# EAGLE design master_pi (EAGLE 8.0.2)
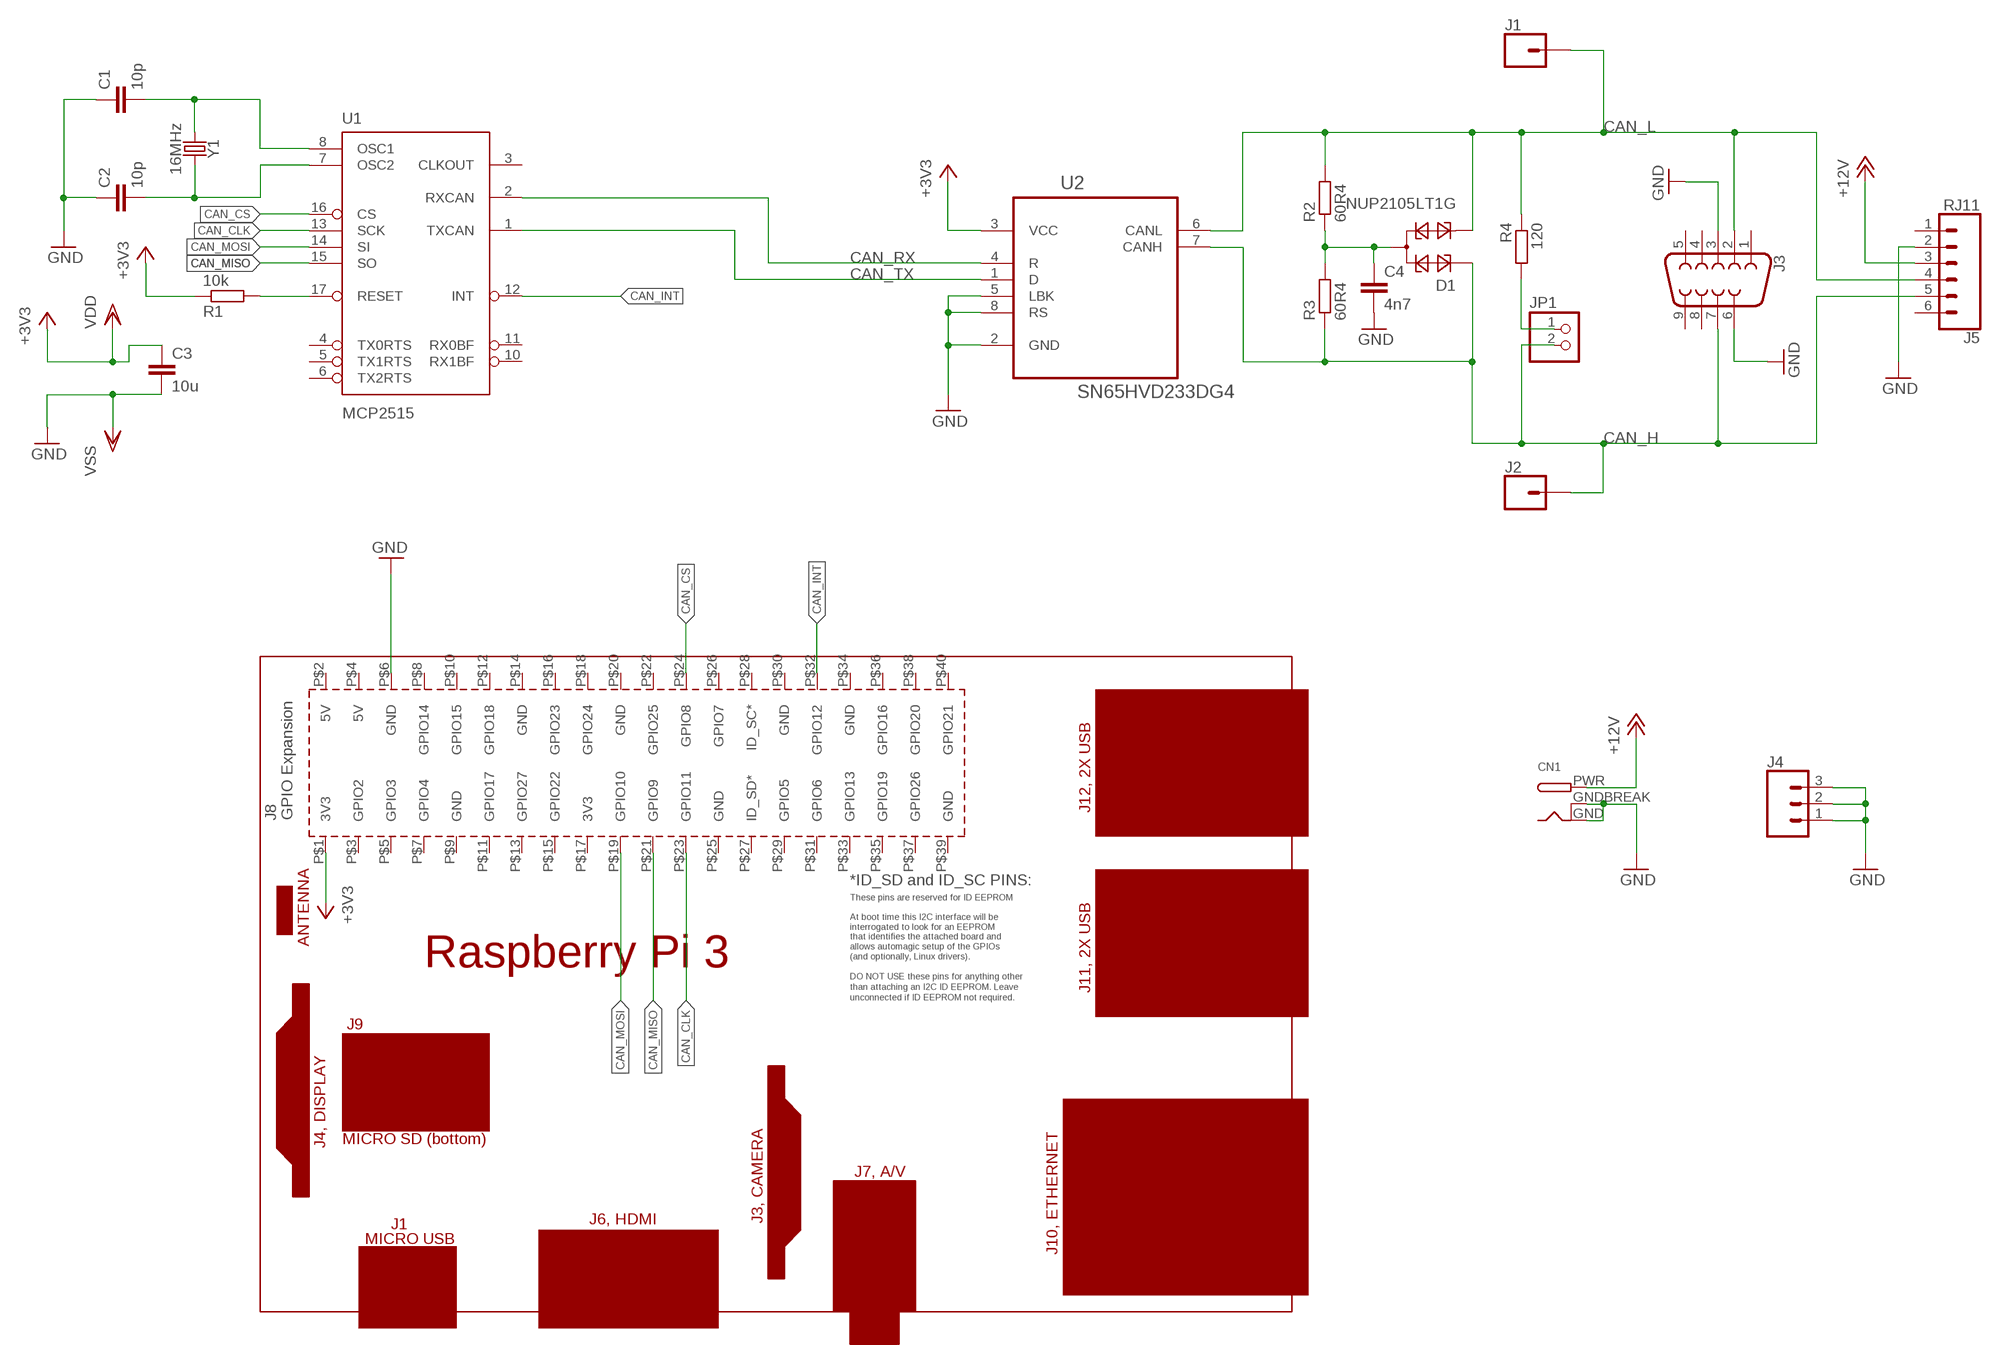
[diagram p0: schematic, sheet 1]

## Parts
C1  10p  C-EUC1206  [C1206]
C2  10p  C-EUC1206  [C1206]
C3  10u  C-EUC1206  [C1206]
C4  4n7  C-EUC1206  [C1206]
CN1  DCBARRELPTH  [DCJACK_2MM_PTH]
D1  NUP2105LT1G  PESD1CAN  [SOT23]
J1  CONN_01  [1X01]
J2  CONN_01  [1X01]
J3  DB9FEMALE  [DB9]
J4  CONN_03  [1X03]
J5  RJ11  RJ11-6  [RJ11-6]
JP1  PINHD-1X2  [1X02]
PCB1  RPI3  [RPI3]
R1  10k  R-EU_R1206  [R1206]
R2  60R4  R-EU_R1206  [R1206]
R3  60R4  R-EU_R1206  [R1206]
R4  120  R-EU_R1206  [R1206]
U1  MCP2515  MCP2515(MCP2510)SO  [SO18W]
U2  SN65HVD233DG4  [SOIC127P600X175-8N]
Y1  16MHz  CRYSTAL-16MHZPTH-HC49US  [HC49US]

## Nets
+3V3 [3v3]: C3.1 PCB1.P$1(3V3) R1.1 U2.3(VCC) ; supply symbol labelled VDD
+12V: CN1.PWR J5.3
CAN_CLK: PCB1.P$23(GPIO11) U1.13(SCK)
CAN_CS: PCB1.P$24(GPIO8) U1.16(CS)
CAN_H: D1.1 J2.1 J3.7 J5.5 JP1.2 R3.1 U2.7(CANH)
CAN_INT: PCB1.P$32(GPIO12) U1.12(INT)
CAN_L: D1.2 J1.1 J3.2 J5.4 R2.2 R4.1 U2.6(CANL)
CAN_MISO: PCB1.P$21(GPIO9) U1.15(SO)
CAN_MOSI: PCB1.P$19(GPIO10) U1.14(SI)
CAN_RX: U1.2(RXCAN) U2.4(R)
CAN_TX: U1.1(TXCAN) U2.1(D)
GND: C1.1 C2.1 C3.2 C4.2 CN1.GND CN1.GNDBREAK J3.3 J3.6 J4.1 J4.2 J4.3 J5.2 PCB1.P$6(GND) U2.2(GND) U2.5(LBK) U2.8(RS) ; supply symbol labelled VSS
N$1: R1.2 U1.17(RESET)
N$2: C4.1 D1.3 R2.1 R3.2
N$12: C1.2 U1.8(OSC1) Y1.1
N$13: C2.2 U1.7(OSC2) Y1.2
N$38: JP1.1 R4.2
Unconnected: J3.1 J3.4 J3.5 J3.8 J3.9 J5.1 J5.6 PCB1.P$2(5V) PCB1.P$3(GPIO2) PCB1.P$4(5V) PCB1.P$5(GPIO3) PCB1.P$7(GPIO4) PCB1.P$8(GPIO14) PCB1.P$9(GND) PCB1.P$10(GPIO15) PCB1.P$11(GPIO17) PCB1.P$12(GPIO18) PCB1.P$13(GPIO27) PCB1.P$14(GND) PCB1.P$15(GPIO22) PCB1.P$16(GPIO23) PCB1.P$17(3V3) PCB1.P$18(GPIO24) PCB1.P$20(GND) PCB1.P$22(GPIO25) PCB1.P$25(GND) PCB1.P$26(GPIO7) PCB1.P$27(ID_SD*) PCB1.P$28(ID_SC*) PCB1.P$29(GPIO5) PCB1.P$30(GND) PCB1.P$31(GPIO6) PCB1.P$33(GPIO13) PCB1.P$34(GND) PCB1.P$35(GPIO19) PCB1.P$36(GPIO16) PCB1.P$37(GPIO26) PCB1.P$38(GPIO20) PCB1.P$39(GND) PCB1.P$40(GPIO21) U1.3(CLKOUT) U1.4(TX0RTS) U1.5(TX1RTS) U1.6(TX2RTS) U1.10(RX1BF) U1.11(RX0BF)

## Power pins joined to a net without a drawn wire
+3V3: U1.18(VDD)
GND: U1.9(VSS)

## Library data of the parts
C1-C4 = resistor:C-EU: CAPACITOR, European symbol
CN1 = adafruit:DCBARREL: 2.0mm DC Barrel Jack DCJACK_2MM_PTH - Through Hole Jack (4UConnector: 05537)
D1 = diode:PESD1CAN: CAN bus ESD protection diode Source: http://www.nxp.com/documents/data_sheet/PESD1CAN.pdf
J1 J2 = SparkFun-Connectors:CONN_01: Single connection point. Often used as Generic Header-pin footprint for 0.1 inch spaced/style header connections On any of the 0.1 inch spaced packages, you can populate with these: Break Away Headers - Straight <https://www.sparkfun.com/products/116> (PRT-00116) Break Away Male Headers - Right Angle <https://www.sparkfun.com/products/553> (PRT-00553) Female Headers <https://www.sparkfun.com/products/115> (PRT-00115) Break Away Headers - Machine Pin <https://www.sparkfun.com/products/117> (PRT-00117) Break Away Female Headers - Swiss Machine Pin <https://www.sparkfun.com/products/743> (PRT-00743) This device is also useful as a general connection point to wire up your design to another part of your project. Our various solder wires solder well into these plated through hole pads. Hook-Up Wire - Assortment (Stranded, 22 AWG) <https://www.sparkfun.com/products/11375> (PRT-11375) Hook-Up Wire - Assortment (Solid Core, 22 AWG) <https://www.sparkfun.com/products/11367> (PRT-11367) View the entire wire category on our website here <https://www.sparkfun.com/categories/141> Special notes: SMTSO-256-ET is a "flush mount" nut for a 4-40 screw. We mostly use this on specialty testbeds; it is a nice way to connect hardware to your PCB at an adjustable hieght. Also note, the SNAP packages are for using a snappable style connector. We sell a baggie of snaps and they are also used on two LilyPad designs: Snap Assortment - 30 pack (male and female) <https://www.sparkfun.com/products/11347> (DEV-11347) LilyPad Arduino SimpleSnap <https://www.sparkfun.com/products/10941> (DEV-10941) LilyPad SimpleSnap Protoboard <https://www.sparkfun.com/products/10940> (DEV-10940)
J3 = SparkFun-Connectors:DB9: DB9 Connector Standard DB9 (D-Sub 9) serial connector. Can be used for CAN bus as well as RS485 and RS232. Footprint production proven. Here is the female version connector we sell at SparkFun: 9 Pin Female Serial Connector - PCB Mount <https://www.sparkfun.com/products/429> (PRT-00429) This connector has been used on the following SparkFun products: SparkFun RS232 Shifter - SMD <https://www.sparkfun.com/products/449> (PRT-00449) SparkFun RS232 Shifter SMD (No DB9) <https://www.sparkfun.com/products/8780> (PRT-08780); PROD_ID: CONN-08194
J4 = SparkFun-Connectors:CONN_03: Multi connection point. Often used as Generic Header-pin footprint for 0.1 inch spaced/style header connections On any of the 0.1 inch spaced packages, you can populate with these: Break Away Headers - Straight <https://www.sparkfun.com/products/116> (PRT-00116) Break Away Male Headers - Right Angle <https://www.sparkfun.com/products/553> (PRT-00553) Female Headers <https://www.sparkfun.com/products/115> (PRT-00115) Break Away Headers - Machine Pin <https://www.sparkfun.com/products/117> (PRT-00117) Break Away Female Headers - Swiss Machine Pin <https://www.sparkfun.com/products/743> (PRT-00743) Stackable Header - 3 Pin (Female, 0.1") <https://www.sparkfun.com/products/13875> (PRT-13875) For SCREWTERMINALS and SPRING TERMINALS visit here: Screw Terimnals on SparkFun.com <https://www.sparkfun.com/search/results?term=Screw+Terminals> (5mm/3.5mm/2.54mm spacing) This device is also useful as a general connection point to wire up your design to another part of your project. Our various solder wires solder well into these plated through hole pads. Hook-Up Wire - Assortment (Stranded, 22 AWG) <https://www.sparkfun.com/products/11375> (PRT-11375) Hook-Up Wire - Assortment (Solid Core, 22 AWG) <https://www.sparkfun.com/products/11367> (PRT-11367) View the entire wire category on our website here <https://www.sparkfun.com/categories/141> Special notes: Molex polarized connector foot print use with SKU : PRT-08232 with associated crimp pins and housings.
J5 = SparkFun-Connectors:RJ11-6: RJ11 Jack - 6 pin Commonly found on CAT3 devices and some Microchip programmers. Here is the connector we sell at SparkFun: RJ11 6-Pin Connector <https://www.sparkfun.com/products/132> (PRT-00132) Datasheet <http://www.sparkfun.com/datasheets/Prototyping/Connectors/RJ11-Datasheet.pdf> It is used on this SparkFun product: SparkFun Weather Shield <https://www.sparkfun.com/products/12081> (DEV-12081) Weather Meters <https://www.sparkfun.com/products/8942> (SEN-08942); PROD_ID: CONN-08590; SF_ID: PRT-00132
JP1 = pinhead:PINHD-1X2: PIN HEADER
PCB1 = e14_Rpi3_RevA:RPI3: Device for Raspberry Pi 3 board created by Dave Young for www.element14.com More information and support community is available at https://www.element14.com/community/community/raspberry-pi
R1-R4 = rcl:R-EU_: RESISTOR, European symbol
U1 = SparkFun-IC-Comms:MCP2515(MCP2510): CAN controller with SPI interface The MCP2515 controller supercedes the MCP2510 while addressing all errata associated with it. The two devices are pin compatible, either can be used with this device. 18-pin package SOIC Simple SPI interface to any MCU. One-shot mode ensures message transmission is attempted only once Databyte filtering Start-of-Frame (SOF) output Low-power CMOS Technology Datasheet <http://www.sparkfun.com/datasheets/DevTools/Arduino/MCP2515.pdf> SparkFun Products CAN-BUS Shield <https://www.sparkfun.com/products/13262> (DEV-13262); PROD_ID: IC-09906
U2 = SN65HVD233DG4:SN65HVD233DG4: CAN TRANSCEIVERS; MPN: SN65HVD233DG4; OC_FARNELL: 1207268; OC_NEWARK: 16M2304; PACKAGE: SOIC-8; SUPPLIER: TI
Y1 = SparkFun-Clocks:CRYSTAL-16MHZ: 16MHz Crystal Digikey Example <http://www.digikey.com/product-search/en?keywords=535-9122-1-ND> Frequency: 16MHz Frequency Stability: ±50ppm Frequency Tolerance: ±20ppm Load Capacitance: 18pF SparkFun Products: Pro Micro -5V/16MHz <https://www.sparkfun.com/products/12640> SparkFun Serial Enabled LCD Kit <https://www.sparkfun.com/products/10097>; PROD_ID: XTAL-08181; SF_ID: COM-00536

## Net classes
0 default: width 0.25 mm
2 3v3: width 0.75 mm

## Board
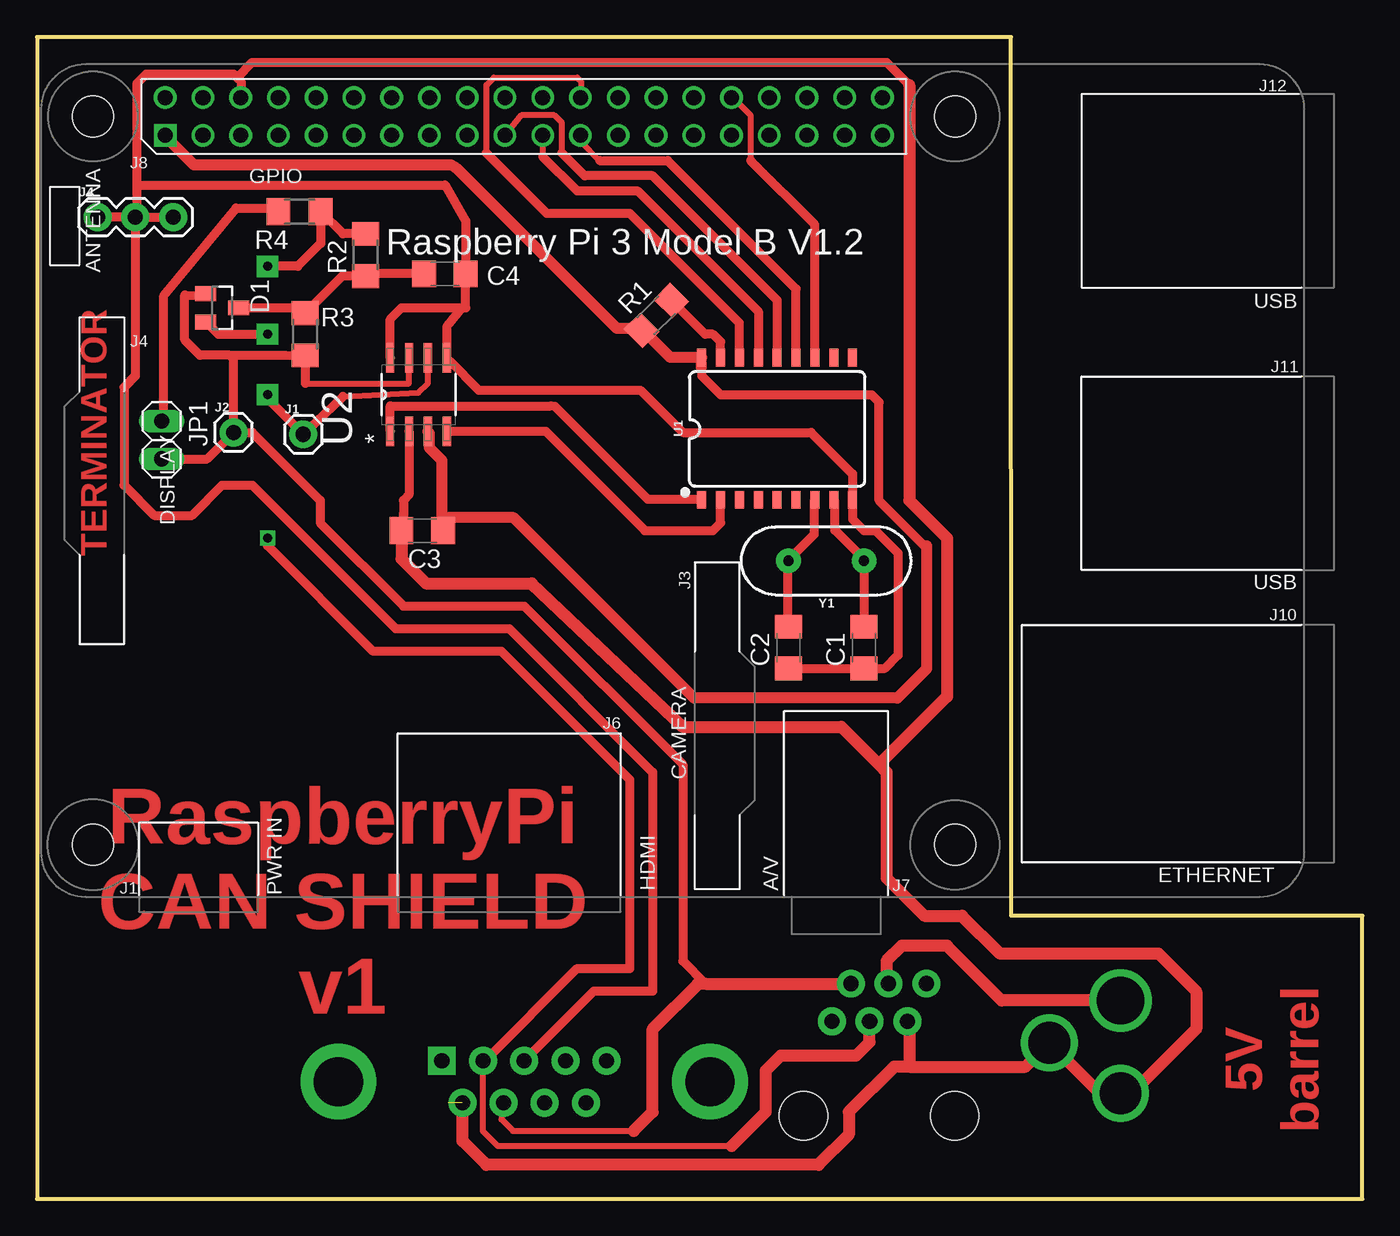
[diagram p1: board, top side]
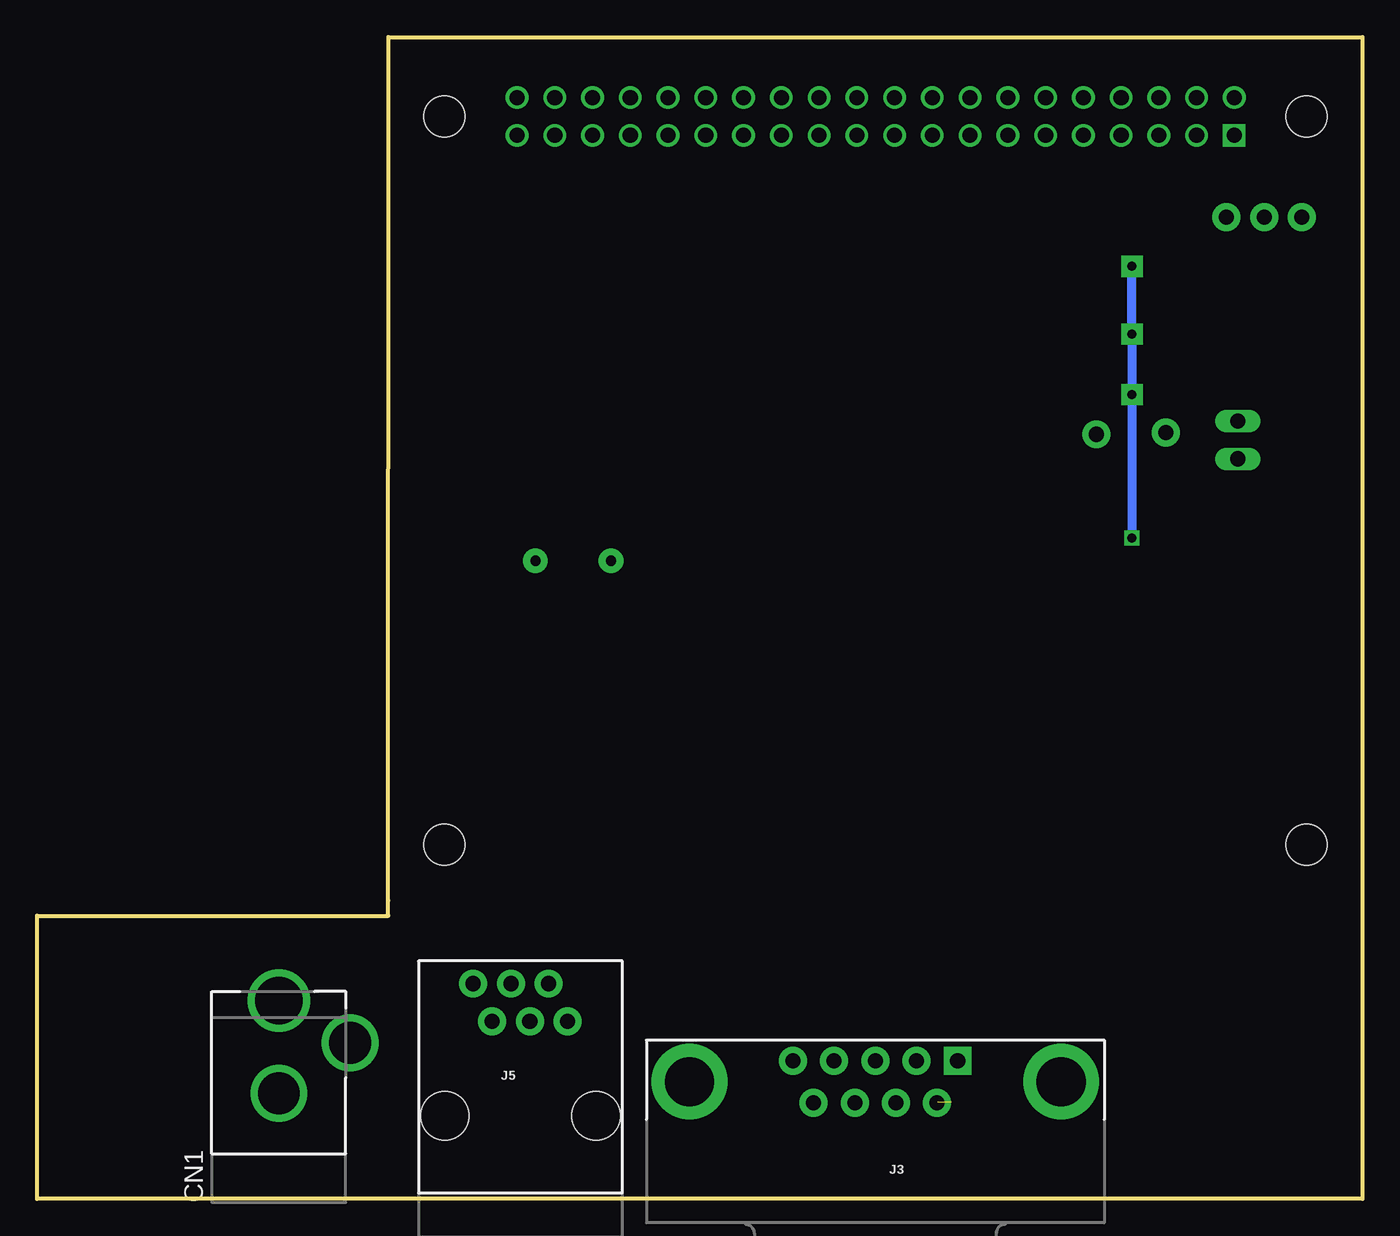
[diagram p2: board, bottom side, seen from below]

Size 89.15 x 78.16 mm. Coordinates in mm from the lower left corner, seen from the top.
Outline: 0,0 89.15,0 89.15,19.05 65.53,19.05 65.53,20.07 65.51,78.16 0,78.16 0,0
Copper layers (1*16): Top 0.035mm / dielectric 1.5mm / Bottom 0.035mm
Design rules "default *": minimum track width 10mil, minimum drill 24mil, track to track 0.3mm, track to pad 0.3mm, pad to pad 8mil, via to via 8mil, smd to smd 8mil, copper to edge 40mil, drill to drill 8mil, minimum pad ring 10mil, minimum via ring 8mil, stop-mask expansion 4mil, vias tented up to drill 0mil, thermal gap 10mil

### Footprints (pad centres in the part's own frame; a part is rotated, then mirrored left to right if it is on the bottom)
C1206 = smd 1.6 x 1.8: 1 -1.4,0; 2 1.4,0
DCJACK_2MM_PTH = drill 2.8: GND 0,7.35; GNDBREAK 4.8,10.75 | drill 3.2: PWR 0,13.6
SOT23 = smd 1 x 1.4: 1 -0.95,-1.1; 2 0.95,-1.1; 3 0,1.1
1X01 = drill 1.016 pad 1.88: 1 0,0
DB9 = drill 1.016 pad 1.88 square: 1 -5.54,-1.42 | drill 1.016 pad 1.88: 2 -2.77,-1.42; 3 0,-1.42; 4 2.77,-1.42; 5 5.54,-1.42; 6 -4.15,1.42; 7 -1.38,1.42; 8 1.38,1.42; 9 4.15,1.42 | drill 3.302 pad 5.08: G1 -12.5,0; G2 12.5,0
1X03 = drill 1.016 pad 1.88: 1 0,0; 2 2.54,0; 3 5.08,0
RJ11-6 = drill 1.016 pad 1.88: 1 -3.175,8.89; 2 -1.905,6.35; 3 -0.635,8.89; 4 0.635,6.35; 5 1.905,8.89; 6 3.175,6.35 | hole 3.251: -5.08,0; 5.08,0
1X02 = drill 1.016 long: 1 -1.27,0; 2 1.27,0
RPI3 = drill 1.016 square: P$1 8.37,51.23 | drill 1.016: P$2 8.357,53.772; P$3 10.897,51.232; P$4 10.897,53.772; P$5 13.437,51.232; P$6 13.437,53.772; P$7 15.977,51.232; P$8 15.977,53.772; P$9 18.517,51.232; P$10 18.517,53.772; P$11 21.057,51.232; P$12 21.057,53.772; P$13 23.597,51.232; P$14 23.597,53.772; P$15 26.137,51.232; P$16 26.137,53.772; P$17 28.677,51.232; P$18 28.677,53.772; P$19 31.217,51.232; P$20 31.217,53.772; P$21 33.757,51.232; P$22 33.757,53.772; P$23 36.297,51.232; P$24 36.297,53.772; P$25 38.837,51.232; P$26 38.837,53.772; P$27 41.377,51.232; P$28 41.377,53.772; P$29 43.917,51.232; P$30 43.917,53.772; P$31 46.457,51.232; P$32 46.457,53.772; P$33 48.997,51.232; P$34 48.997,53.772; P$35 51.537,51.232; P$36 51.537,53.772; P$37 54.077,51.232; P$38 54.077,53.772; P$39 56.617,51.232; P$40 56.617,53.772 | hole 2.75: 3.5,3.5; 61.5,3.5; 3.5,52.5; 61.5,52.5
R1206 = smd 1.6 x 1.803: 1 -1.422,0; 2 1.422,0
SO18W = smd 0.6 x 1.2: 1 -5.08,-4.788; 2 -3.81,-4.788; 3 -2.54,-4.788; 4 -1.27,-4.788; 5 0,-4.788; 6 1.27,-4.788; 7 2.54,-4.788; 8 3.81,-4.788; 9 5.08,-4.788; 10 5.08,4.788; 11 3.81,4.788; 12 2.54,4.788; 13 1.27,4.788; 14 0,4.788; 15 -1.27,4.788; 16 -2.54,4.788; 17 -3.81,4.788; 18 -5.08,4.788
SOIC127P600X175-8N = smd 1.981 x 0.559: 1 -2.464,1.905; 2 -2.464,0.635; 3 -2.464,-0.635; 4 -2.464,-1.905; 5 2.464,-1.905; 6 2.464,-0.635; 7 2.464,0.635; 8 2.464,1.905
HC49US = drill 0.7 pad 1.651: 1 -2.54,0; 2 2.54,0

### Placement (x,y rotation side)
C1  55.63,37.08 90 top
C2  50.55,37.08 90 top
C3  25.91,44.96 180 top
C4  27.43,62.23 0 top
CN1  72.9,-0.25 0 bottom
D1  12.45,59.94 270 top
J1  17.91,51.44 0 top
J2  13.21,51.56 0 top
J3  32.77,7.87 180 bottom
J4  4.06,66.04 0 top
J5  56.64,5.59 0 bottom
JP1  8.38,51.05 270 top
PCB1  0.25,20.32 0 top
R1  41.66,59.44 45 top
R2  22.1,63.5 90 top
R3  18.03,58.17 90 top
R4  17.65,66.42 180 top
U1  49.78,51.82 0 top
U2  25.65,54.1 90 top
Y1  53.09,42.93 180 top

### Tracks (layer width: path | path; a pad name or v marks a point on that pad's centre or on a via)
+3V3
  Top 0.61: 59.85,43.93 59.7,43.93 56.64,46.99 56.64,53.59 56.39,53.85 56.13,54.1 45.97,54.1 44.7,55.37 U1.18
  Top 0.75: PCB1.P$1 8.66,71.44 10.55,69.55 27.86,69.55 28.18,69.37 38.99,58.57 40.37,58.57 R1.1 40.79,58.43 42.59,56.63 44.67,56.63 U1.18 44.67,56.21 44.67,55.93 | U2.3 26.38,51.5 26.38,50.53 27.21,49.7 27.21,46.1 C3.1 27.63,45.82 32.06,45.82 44.2,33.68 57.87,33.68 59.85,35.67 59.85,43.93
+12V
  Top 0.813: CN1.PWR 64.89,13.35 61.21,17.02 58.17,17.02 57.15,16 57.15,14.61 J5.3
CAN_CLK
  Top 0.406: PCB1.P$23 36.55,71.14 37.85,69.85
  Top 0.61: U1.13 51.05,61.21 42.42,69.85 37.85,69.85
CAN_CS
  Top 0.406: 30.23,70.36 30.23,74.93 30.73,75.44 36.32,75.44 36.58,75.18 36.58,74.12
  Top 0.61: U1.16 47.24,58.93 39.88,66.29 34.29,66.29 30.23,70.36 | 36.58,74.12 PCB1.P$24
CAN_H
  Top 0.254: 11.29,60.78 D1.1 | 25.02,55.88 U2.7
  Top 0.406: 25.02,55.88 25.02,54.86 18.03,54.86 | J3.7 31.24,6.31 31.24,5.33 32,4.57 40.13,4.57
  Top 0.61: 11.29,60.78 9.93,60.82 9.93,57.78 10.94,56.76 12.95,56.76 | 12.95,56.76 16.69,56.76 R3.1 18.03,54.86 | J2.1 14.48,51.56 19.05,46.99 19.05,45.47 24.64,39.88 32.77,39.88 43.43,29.21 43.43,16 44.96,14.48 | J2.1 13.21,56.51 12.95,56.76 | JP1.2 11.43,49.78 J2.1
  Top 0.813: 40.13,4.57 41.4,5.84 41.4,11.43 44.45,14.48 44.96,14.48 J5.5
CAN_INT
  Top 0.406: PCB1.P$32 46.81,74.09 48.01,72.9 48.01,69.85
  Top 0.61: U1.12 52.32,65.53 48.01,69.85
CAN_L  (via drill 0.6, 0.6 pad 1.42)
  Top 0.406: 18.16,51.69 J1.1 | 20.57,53.98 25.65,54.23 26.29,54.86 U2.6 | J3.2 29.97,9.27 29.97,4.57 30.99,3.56 46.74,3.56
  Top 0.61: 18.16,51.69 20.57,53.98 | D1.2 11.36,58.99 12.19,58.17 v15.49,58.17 | v15.49,54.1 15.49,53.85 J1.1 | v15.49,44.45 15.49,43.94 22.61,36.83 31.24,36.83 39.88,28.19 39.88,15.49 36.32,15.49 30.12,9.29 J3.2 | R2.2 20.57,64.92 R4.1 19.07,64.29 17.53,62.74 v15.49,62.74
  Top 0.813: 46.74,3.56 49.02,5.84 49.02,8.64 50.04,9.65 55.12,9.65 56.01,10.54 J5.4
  Bottom 0.61: v15.49,62.74 v15.49,58.17 v15.49,54.1 v15.49,44.45
CAN_MISO
  Top 0.406: PCB1.P$21 34.01,70.13
  Top 0.61: 34.01,70.13 36.32,67.82 40.39,67.82 48.51,59.69 U1.15
CAN_MOSI
  Top 0.406: 35.31,70.36 35.31,72.39 34.8,72.9 32.56,72.9 PCB1.P$19
  Top 0.61: 35.31,70.36 36.83,68.83 41.4,68.83 49.78,60.45 U1.14
CAN_RX
  Top 0.61: U2.4 34.21,51.64 40.89,44.96 45.47,44.96 45.97,45.47 U1.2
CAN_TX
  Top 0.254: 44.67,47.07 U1.1 | 34.83,53.3 34.54,53.34
  Top 0.61: 34.54,53.34 23.75,53.34 U2.1 | 44.67,47.07 41.06,47.07 34.83,53.3
GND  (1 unrouted)
  Top 0.254: 3.95,65.91 J4.1 4.09,66.04 | 9.07,66.04 J4.3 | 6.72,66.04 J4.2 6.58,66.04 | 28.83,64.13 C4.2 | 54.78,47.48 54.78,47.07 U1.9 | 27.77,56.35 U2.5 | J3.6 28.6,6.49
  Top 0.406: 28.57,59.94 28.83,59.95
  Top 0.61: 6.72,68.2 6.72,66.04 9.07,66.04 | 6.58,66.04 4.09,66.04 | 6.72,68.2 27.43,68.2 28.83,65.79 C4.2 28.83,59.95 | U2.5 27.56,58.67 28.57,59.94 24.51,59.94 23.75,59.18 U2.8 | 6.72,68.2 6.72,75.04 7.37,75.69 13.21,75.69 13.46,75.44 | 13.46,75.44 13.72,75.18 13.72,74.12 PCB1.P$6 | 27.77,56.35 29.71,54.41 40.59,54.41 43.43,51.56 52.07,51.56 54.86,48.77 U1.9 54.86,45.72 55.63,44.96 56.39,44.96 57.91,43.43 57.91,36.58 57.02,35.68 C1.1 C2.1 | 13.46,75.44 14.48,76.45 57.15,76.45 58.67,74.93 | J4.2 6.6,55.37 5.84,54.61 5.84,48.01 7.87,45.97 10.41,45.97 12.45,48.01 14.48,48.01 24.13,38.35 31.75,38.35 41.4,28.7 41.4,13.97 37.44,13.97 J3.3 | U2.2 25.02,47.37 24.64,46.99 24.64,46.1 C3.2
  Top 0.813: C3.2 24.51,43.06 26.16,41.4 33.27,41.4 43.43,31.75 54.1,31.75 56.64,29.21 | 56.64,29.21 57.15,28.7 57.15,21.59 59.69,19.05 62.23,19.05 64.77,16.51 75.44,16.51 77.98,13.97 77.98,11.43 73.64,7.1 CN1.GND 71.5,7.1 CN1.GNDBREAK 66.49,8.89 58.67,8.89 | 58.67,8.89 57.66,8.89 54.61,5.84 54.61,4.32 52.58,2.29 30.23,2.29 28.62,3.9 J3.6 | J5.2 58.67,11.81 58.67,8.89 | 58.67,74.93 58.67,46.99 61.21,44.45 61.21,33.78 56.64,29.21
N$1
  Top 0.254: 45.91,56.63 U1.17 | R1.2 42.73,60.37
  Top 0.61: R1.2 44.94,58.17 45.47,58.17 45.97,57.66 U1.17
N$2
  Top 0.406: R3.2 17.68,59.94
  Top 0.61: D1.3 17.68,59.94 | R3.2 20.52,62.08 R2.1 22.25,62.23 C4.1
N$12
  Top 0.254: 53.67,46.93 U1.8 | 55.61,43.05 Y1.1 55.61,42.91 | 55.61,38.62 C1.2
  Top 0.61: 53.67,46.93 53.67,44.99 55.61,43.05 | 55.61,42.91 55.61,38.62
N$13
  Top 0.254: 52.28,46.93 U1.7 | 50.62,43.05 Y1.2 50.48,42.91 | 50.48,38.62 C2.2
  Top 0.61: 52.28,46.93 52.28,44.71 50.62,43.05 | 50.48,42.91 50.48,38.62
N$38
  Top 0.254: 15.81,66.67 R4.2 | 8.52,52.33 JP1.1
  Top 0.61: 15.81,66.67 13.39,66.67 8.52,60.78 8.52,52.33

### Text on the board
Top: TERMINATOR | RaspberryPi / CAN SHIELD / v1 | 5V / barrel